# EAGLE schematic CentralBoard (EAGLE 7.6.0)
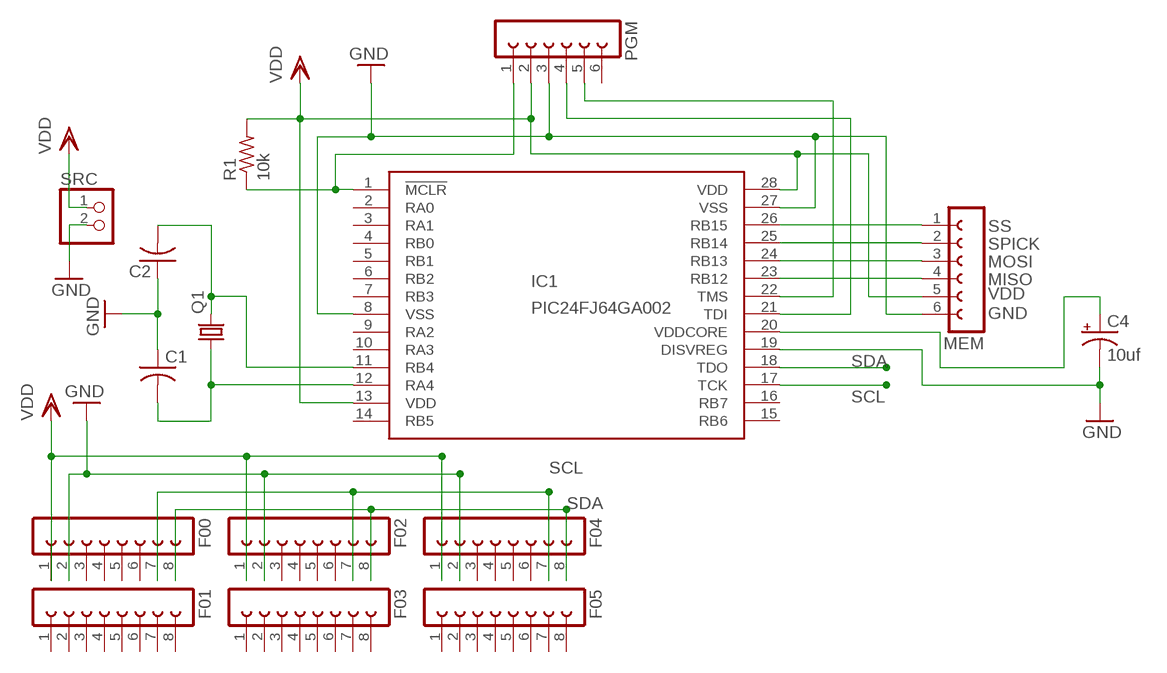
[diagram p0: schematic, sheet 1]

## Parts
C1  C-US025-030X050  [C025-030X050]
C2  C-US025-030X050  [C025-030X050]
C4  10uf  CPOL-USE5-8.5  [E5-8,5]
F00  FE08-1  [FE08]
F01  FE08-1  [FE08]
F02  FE08-1  [FE08]
F03  FE08-1  [FE08]
F04  FE08-1  [FE08]
F05  FE08-1  [FE08]
IC1  PIC24FJ64GA002  [DIL28-3]
MEM  FE06-1  [FE06]
PGM  FE06-1  [FE06]
Q1  CRYSTALTC26V  [TC26V]
R1  10k  R-US_0204/7  [0204/7]
SRC  PINHD-1X2  [1X02]

## Nets
GND: C1.1 C2.1 C4.- F00.2 F02.2 F04.2 IC1.8(VSS) IC1.19(DISVREG) IC1.27(VSS) MEM.6 PGM.3 SRC.2
MISO: IC1.23(RB12) MEM.4
MOSI: IC1.24(RB13) MEM.3
N$1: IC1.1(!MCLR) PGM.1 R1.1
N$2: C1.2 IC1.12(RA4) Q1.1
N$3: C2.2 IC1.11(RB4) Q1.2
N$4: IC1.21(TDI) PGM.4
N$5: IC1.22(TMS) PGM.5
N$6: C4.+ IC1.20(VDDCORE)
SCL: F00.7 F02.7 F04.7 IC1.17(TCK)
SDA: F00.8 F02.8 F04.8 IC1.18(TDO)
SPICK: IC1.25(RB14) MEM.2
SS: IC1.26(RB15) MEM.1
VDD: F00.1 F02.1 F04.1 IC1.13(VDD) IC1.28(VDD) MEM.5 PGM.2 R1.2 SRC.1
Unconnected: F00.3 F00.4 F00.5 F00.6 F01.1 F01.2 F01.3 F01.4 F01.5 F01.6 F01.7 F01.8 F02.3 F02.4 F02.5 F02.6 F03.1 F03.2 F03.3 F03.4 F03.5 F03.6 F03.7 F03.8 F04.3 F04.4 F04.5 F04.6 F05.1 F05.2 F05.3 F05.4 F05.5 F05.6 F05.7 F05.8 IC1.2(RA0) IC1.3(RA1) IC1.4(RB0) IC1.5(RB1) IC1.6(RB2) IC1.7(RB3) IC1.9(RA2) IC1.10(RA3) IC1.14(RB5) IC1.15(RB6) IC1.16(RB7) PGM.6

## Library data of the parts
C1 C2 = adafruit:C-US: CAPACITOR, American symbol
C4 = adafruit:CPOL-US: POLARIZED CAPACITOR, American symbol
F00 F01-F05 = con-lsta:FE08-1: FEMALE HEADER; OC_FARNELL: unknown; OC_NEWARK: unknown
IC1 = microchip:PIC24FJ64GA002: PIC24FJ64GA002 edit this description Auto generated by make-symbol-device-package-bsdl.ulp Rev. 25 Source: PIC24FJ64GA002.bsd; MPN: PIC24FJ64GA002-I/SP; OC_FARNELL: 1332298; OC_NEWARK: 88K6132
MEM PGM = con-lsta:FE06-1: FEMALE HEADER; OC_FARNELL: unknown; OC_NEWARK: unknown
Q1 = crystal:CRYSTAL: CRYSTAL; OC_FARNELL: unknown; OC_NEWARK: unknown
R1 = resistor:R-US_: RESISTOR, American symbol
SRC = pinhead:PINHD-1X2: PIN HEADER